# Altium schematic sheet SchemaBloc.SchDoc
size A3; Date: 26.01.2022; Author: Ali Zoubir; CompanyName: ETML-ES; DrawnBy: Ali Zoubir; Engineer: Ali Zoubir; Organization: ETML-ES; Address1: Avenue Recordon 1; Address2: 1004 Lausanne; Address3: Switzerland; Revision: 1924B; SheetNumber: 1; SheetTotal: 4; Version: V0
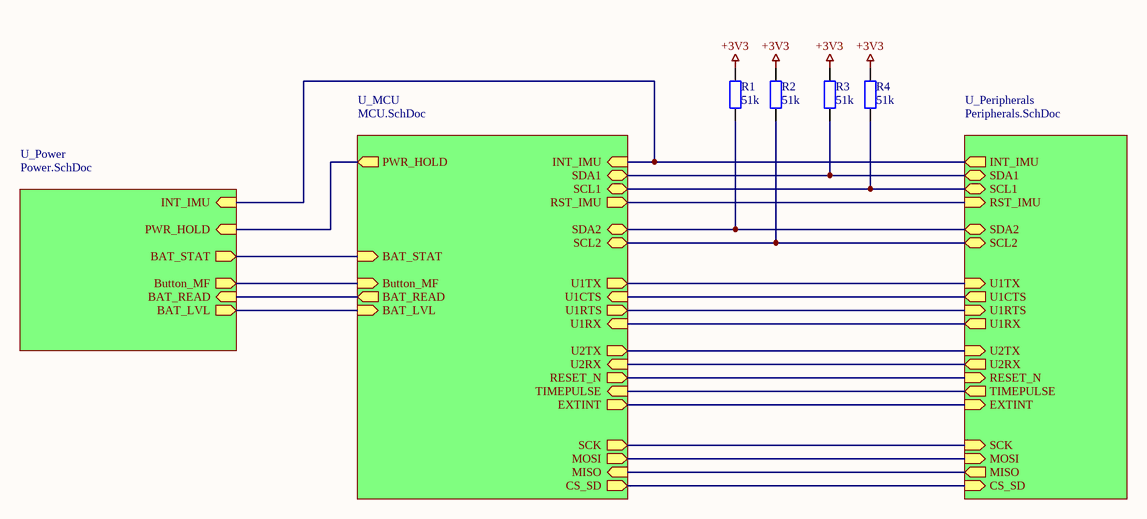
[diagram p0: SchemaBloc.SchDoc]

## Parts
R1  51k  [RES_0805]
R2  51k  [RES_0805]
R3  51k  [RES_0805]
R4  51k  [RES_0805]

## Sub-sheets
U_MCU = MCU.SchDoc: SDA1 (bidir), SCL1 (bidir), CS_SD (out), BAT_STAT (in), RST_IMU (out), INT_IMU (in), PWR_HOLD (out), SDA2 (bidir), SCL2 (bidir), U1TX (out), U1RX (in), MISO (in), MOSI (out), SCK (out), Button_MF (in), BAT_LVL (in), BAT_READ (out), U2TX (out), U1CTS (in), U1RTS (out), U2RX (in), RESET_N (out), EXTINT (out), TIMEPULSE (in)
U_Peripherals = Peripherals.SchDoc: SDA1 (bidir), SCL1 (bidir), RST_IMU (in), INT_IMU (out), U1TX (in), U1CTS (out), U1RTS (in), U1RX (out), SCL2 (bidir), SDA2 (bidir), SCK (in), MOSI (in), MISO (out), CS_SD (in), U2RX (out), U2TX (in), RESET_N (in), EXTINT (in), TIMEPULSE (out)
U_Power = Power.SchDoc: BAT_STAT (out), Button_MF (out), BAT_READ (in), BAT_LVL (out), INT_IMU (in), PWR_HOLD (in)

## Nets
+3V3: R1.2 R2.2 R3.2 R4.2
NetR1_1: R1.1 ; sheet U_MCU/SDA2, sheet U_Peripherals/SDA2
NetR2_1: R2.1 ; sheet U_MCU/SCL2, sheet U_Peripherals/SCL2
NetR3_1: R3.1 ; sheet U_MCU/SDA1, sheet U_Peripherals/SDA1
NetR4_1: R4.1 ; sheet U_MCU/SCL1, sheet U_Peripherals/SCL1
(unnamed): sheet U_MCU/CS_SD, sheet U_Peripherals/CS_SD
(unnamed): sheet U_MCU/BAT_STAT, sheet U_Power/BAT_STAT
(unnamed): sheet U_MCU/RST_IMU, sheet U_Peripherals/RST_IMU
(unnamed): sheet U_MCU/INT_IMU, sheet U_Power/INT_IMU, sheet U_Peripherals/INT_IMU
(unnamed): sheet U_MCU/PWR_HOLD, sheet U_Power/PWR_HOLD
(unnamed): sheet U_MCU/U1TX, sheet U_Peripherals/U1TX
(unnamed): sheet U_MCU/U1RX, sheet U_Peripherals/U1RX
(unnamed): sheet U_MCU/MISO, sheet U_Peripherals/MISO
(unnamed): sheet U_MCU/MOSI, sheet U_Peripherals/MOSI
(unnamed): sheet U_MCU/SCK, sheet U_Peripherals/SCK
(unnamed): sheet U_MCU/Button_MF, sheet U_Power/Button_MF
(unnamed): sheet U_MCU/BAT_LVL, sheet U_Power/BAT_LVL
(unnamed): sheet U_MCU/BAT_READ, sheet U_Power/BAT_READ
(unnamed): sheet U_MCU/U2TX, sheet U_Peripherals/U2TX
(unnamed): sheet U_MCU/U1CTS, sheet U_Peripherals/U1CTS
(unnamed): sheet U_MCU/U1RTS, sheet U_Peripherals/U1RTS
(unnamed): sheet U_MCU/U2RX, sheet U_Peripherals/U2RX
(unnamed): sheet U_MCU/RESET_N, sheet U_Peripherals/RESET_N
(unnamed): sheet U_MCU/EXTINT, sheet U_Peripherals/EXTINT
(unnamed): sheet U_MCU/TIMEPULSE, sheet U_Peripherals/TIMEPULSE

## Notes on the sheet
- Fichier :
- a
- Date :
- Heure :
- Version :
- Auteur :
- Modif.
- b
- c
- d
- Projet :
- No :
- Nb feuilles
- Feuille n°
- Chemin :

## Library data of the parts
R1-R4 = Res2: Res 0805; Value: 1k; Published: 8-Jun-2000; LatestRevisionDate: 17-Jul-2002; LatestRevisionNote: Re-released for DXP Platform.; PackageReference: AXIAL-0.4; Publisher: Altium Limited; PackageDescription: Axial Device, Thru-Hole; 2 Leads; 0.4 in Pin Spacing